# EAGLE design main (EAGLE 9.6.2)
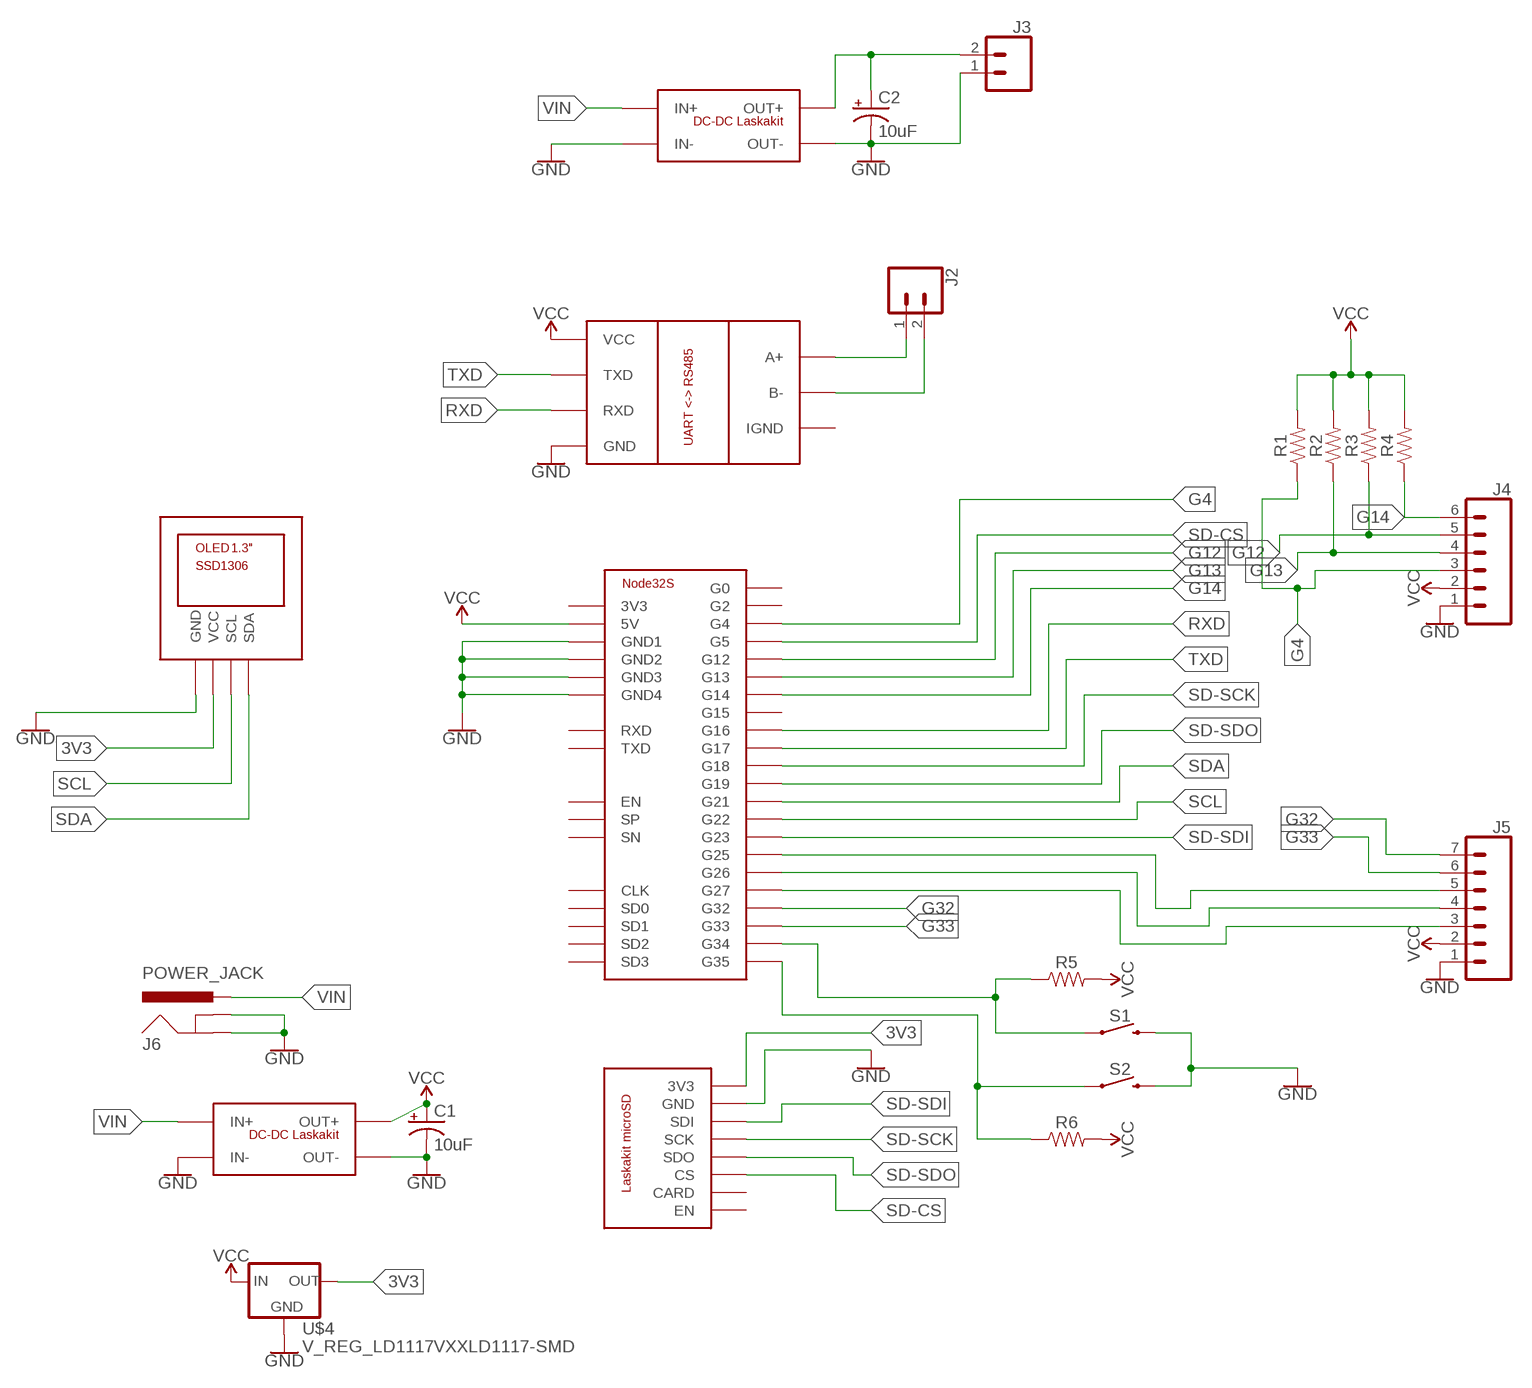
[diagram p0: schematic, sheet 1]

## Parts
C1  10uF  10UF-POLAR-RADIAL-2.5MM-25V-20%  [CPOL-RADIAL-2.5MM-5MM]
C2  10uF  10UF-POLAR-RADIAL-2.5MM-25V-20%  [CPOL-RADIAL-2.5MM-5MM]
J2  CONN_025MM  [SCREWTERMINAL-5MM-2]
J3  CONN_025MM  [SCREWTERMINAL-5MM-2]
J4  CONN_06NO_SILK_FEMALE_PTH  [1X06_NO_SILK]
J5  CONN_07NO_SILK  [1X07_NO_SILK]
J6  POWER_JACK  [POWER_JACK_PTH]
R1  RESISTOR0805  [0805]
R2  RESISTOR0805  [0805]
R3  RESISTOR0805  [0805]
R4  RESISTOR0805  [0805]
R5  RESISTOR0805  [0805]
R6  RESISTOR0805  [0805]
S1  MOMENTARY-SWITCH-SPST-PTH-12MM  [TACTILE_SWITCH_PTH_12MM]
S2  MOMENTARY-SWITCH-SPST-PTH-12MM  [TACTILE_SWITCH_PTH_12MM]
U$1  NODE32S  [NODE32S]
U$2  LASKAKIT_SDCARD  [LASKAKIT_SD_MODULE]
U$3  DC-DC-LASKAKIT  [DC-DC-MODULE-LASKAKIT]
U$4  V_REG_LD1117VXXLD1117-SMD  [SOT223]
U$5  RS485-UART-CONVERTER  [RS485_MODULE]
U$6  OLED_0.96_I2C  [OLED_0.96]
U$7  DC-DC-LASKAKIT  [DC-DC-MODULE-LASKAKIT]

## Nets
3V3: U$2.P$1(3V3) U$4.2(OUT) U$6.P$2(VCC)
G4: J4.3 R1.1 U$1.P$26(G4)
G12: J4.5 R3.1 U$1.P$13(G12)
G13: J4.4 R2.1 U$1.P$15(G13)
G14: J4.6 R4.1 U$1.P$12(G14)
G32: J5.7 U$1.P$7(G32)
G33: J5.6 U$1.P$8(G33)
GND: C1.2(-) C2.2(-) J3.1 J4.1 J5.1 J6.GND J6.GNDBREAK S1.3 S2.3 U$1.P$14(GND1) U$1.P$18(GND2) U$1.P$32(GND3) U$1.P$38(GND4) U$2.P$2(GND) U$3.IN- U$3.OUT- U$4.1(GND) U$5.GND U$6.P$1(GND) U$7.IN- U$7.OUT-
N$1: J2.1 U$5.A+
N$2: J2.2 U$5.B-
N$7: J5.5 U$1.P$9(G25)
N$8: J5.4 U$1.P$10(G26)
N$9: J5.3 U$1.P$11(G27)
N$12: C2.1(+) J3.2 U$7.OUT+
N$13: R6.1 S2.1 U$1.P$6(G35)
N$14: R5.1 S1.1 U$1.P$5(G34)
RXD: U$1.P$27(G16) U$5.RXD
SCL: U$1.P$36(G22) U$6.P$3(SCL)
SD-CS: U$1.P$29(G5) U$2.P$6(CS)
SD-SCK: U$1.P$30(G18) U$2.P$4(SCK)
SD-SDI: U$1.P$37(G23) U$2.P$3(SDI)
SD-SDO: U$1.P$31(G19) U$2.P$5(SDO)
SDA: U$1.P$33(G21) U$6.P$4(SDA)
TXD: U$1.P$28(G17) U$5.TXD
VCC: C1.1(+) J4.2 J5.2 R1.2 R2.2 R3.2 R4.2 R5.2 R6.2 U$1.P$19(5V) U$3.OUT+ U$4.3(IN) U$5.VCC
VIN: J6.PWR U$3.IN+ U$7.IN+
Unconnected: U$1.P$1(3V3) U$1.P$2(EN) U$1.P$3(SP) U$1.P$4(SN) U$1.P$16(SD2) U$1.P$17(SD3) U$1.P$20(CLK) U$1.P$21(SD0) U$1.P$22(SD1) U$1.P$23(G15) U$1.P$24(G2) U$1.P$25(G0) U$1.P$34(RXD) U$1.P$35(TXD) U$2.P$7(CARD) U$2.P$8(EN) U$5.ISOGND(IGND)

## Library data of the parts
C1 C2 = SparkFun-Capacitors:10UF-POLAR: 10.0µF polarized capacitors A capacitor is a passive two-terminal electrical component used to store electrical energy temporarily in an electric field.; PROD_ID: CAP-08440
J2 J3 = SparkFun-Connectors:CONN_02: Multi connection point. Often used as Generic Header-pin footprint for 0.1 inch spaced/style header connections On any of the 0.1 inch spaced packages, you can populate with these: Break Away Headers - Straight <https://www.sparkfun.com/products/116> (PRT-00116) Break Away Male Headers - Right Angle <https://www.sparkfun.com/products/553> (PRT-00553) Female Headers <https://www.sparkfun.com/products/115> (PRT-00115) Break Away Headers - Machine Pin <https://www.sparkfun.com/products/117> (PRT-00117) Break Away Female Headers - Swiss Machine Pin <https://www.sparkfun.com/products/743> (PRT-00743) For SCREWTERMINALS and SPRING TERMINALS visit here: Screw Terimnals on SparkFun.com <https://www.sparkfun.com/search/results?term=Screw+Terminals> (5mm/3.5mm/2.54mm spacing) This device is also useful as a general connection point to wire up your design to another part of your project. Our various solder wires solder well into these plated through hole pads. Hook-Up Wire - Assortment (Stranded, 22 AWG) <https://www.sparkfun.com/products/11375> (PRT-11375) Hook-Up Wire - Assortment (Solid Core, 22 AWG) <https://www.sparkfun.com/products/11367> (PRT-11367) View the entire wire category on our website here <https://www.sparkfun.com/categories/141> Special notes: Molex polarized connector foot print use with: PRT-08233 with associated crimp pins and housings. 2.54_SCREWTERM for use with PRT-10571. 3.5mm Screw Terminal footprints for PRT-08084 5mm Screw Terminal footprints for use with PRT-08432; SF_SKU: PRT-08432
J4 = SparkFun-Connectors:CONN_06: Multi connection point. Often used as Generic Header-pin footprint for 0.1 inch spaced/style header connections On any of the 0.1 inch spaced packages, you can populate with these: Break Away Headers - Straight <https://www.sparkfun.com/products/116> (PRT-00116) Break Away Male Headers - Right Angle <https://www.sparkfun.com/products/553> (PRT-00553) Female Headers <https://www.sparkfun.com/products/115> (PRT-00115) Break Away Headers - Machine Pin <https://www.sparkfun.com/products/117> (PRT-00117) Break Away Female Headers - Swiss Machine Pin <https://www.sparkfun.com/products/743> (PRT-00743) Arduino Stackable Header - 6 Pin <https://www.sparkfun.com/products/9280> (PRT-09280) Screw Terminals 2.54mm Pitch (6-Pin) <https://www.sparkfun.com/products/16499> (PRT-16499) For SCREWTERMINALS and SPRING TERMINALS visit here: Screw Terimnals on SparkFun.com <https://www.sparkfun.com/search/results?term=Screw+Terminals> (5mm/3.5mm/2.54mm spacing) This device is also useful as a general connection point to wire up your design to another part of your project. Our various solder wires solder well into these plated through hole pads. Hook-Up Wire - Assortment (Stranded, 22 AWG) <https://www.sparkfun.com/products/11375> (PRT-11375) Hook-Up Wire - Assortment (Solid Core, 22 AWG) <https://www.sparkfun.com/products/11367> (PRT-11367) View the entire wire category on our website here <https://www.sparkfun.com/categories/141>; PROD_ID: CONN-08437
J5 = SparkFun-Connectors:CONN_07: Multi connection point. Often used as Generic Header-pin footprint for 0.1 inch spaced/style header connections On any of the 0.1 inch spaced packages, you can populate with these: Break Away Headers - Straight <https://www.sparkfun.com/products/116> (PRT-00116) Break Away Male Headers - Right Angle <https://www.sparkfun.com/products/553> (PRT-00553) Female Headers <https://www.sparkfun.com/products/115> (PRT-00115) Break Away Headers - Machine Pin <https://www.sparkfun.com/products/117> (PRT-00117) Break Away Female Headers - Swiss Machine Pin <https://www.sparkfun.com/products/743> (PRT-00743) For SCREWTERMINALS and SPRING TERMINALS visit here: Screw Terimnals on SparkFun.com <https://www.sparkfun.com/search/results?term=Screw+Terminals> (5mm/3.5mm/2.54mm spacing) This device is also useful as a general connection point to wire up your design to another part of your project. Our various solder wires solder well into these plated through hole pads. Hook-Up Wire - Assortment (Stranded, 22 AWG) <https://www.sparkfun.com/products/11375> (PRT-11375) Hook-Up Wire - Assortment (Solid Core, 22 AWG) <https://www.sparkfun.com/products/11367> (PRT-11367) View the entire wire category on our website here <https://www.sparkfun.com/categories/141> Special notes: Molex polarized connector foot print use with SKU : PRT-08231 with associated crimp pins and housings. 1MM SMD Version SKU: PRT-10208 NOTES ON THE VARIANTS LOCK and LOCK_LONGPADS... This footprint was designed to help hold the alignment of a through-hole component (i.e. 6-pin header) while soldering it into place. You may notice that each hole has been shifted either up or down by 0.005 of an inch from it's more standard position (which is a perfectly straight line). This slight alteration caused the pins (the squares in the middle) to touch the edges of the holes. Because they are alternating, it causes a "brace" to hold the component in place. 0.005 has proven to be the perfect amount of "off-center" position when using our standard breakaway headers. Although looks a little odd when you look at the bare footprint, once you have a header in there, the alteration is very hard to notice. Also,if you push a header all the way into place, it is covered up entirely on the bottom side.
J6 = SparkFun-Connectors:POWER_JACK: Power Jack Connector This is the standard 5.5mm barrel jack for power. The PTH is the most common, proven, reliable, footprint. The Slot footprint only works if the mill layer is transmitted to the PCB fab house so be warned. Here are the connectors we sell at SparkFun: DC Barrel Power Jack/Connector <https://www.sparkfun.com/products/119> (PRT-00119) DC Barrel Power Jack/Connector (SMD) <https://www.sparkfun.com/products/12748> (PRT-12748) DC Barrel Jack Adapter - Breadboard Compatible <https://www.sparkfun.com/products/10811> (PRT-10811) It is used on this SparkFun product (and many, many others): SparkFun RedBoard - Programmed with Arduino <https://www.sparkfun.com/products/12757> (DEV-12757) Also, if you need a mating power supply or connector, please check these out: Wall Adapter Power Supply - 9VDC 650mA <https://www.sparkfun.com/products/298> (TOL-00298) DC Barrel Jack Adapter - Male <https://www.sparkfun.com/products/10287> (PRT-10287); PROD_ID: CONN-08197
R1-R6 = SparkFun-Resistors:RESISTOR: Generic Resistor Package
S1 S2 = SparkFun-Switches:MOMENTARY-SWITCH-SPST: Momentary Switch (Pushbutton) - SPST Normally-open (NO) SPST momentary switches (buttons, pushbuttons). Variants PTH-12MM - 12mm square, through-hole Momentary Pushbutton Switch - 12mm Square <https://www.sparkfun.com/products/9190> (COM-09190) PTH-6.0MM, PTH-6.0MM-KIT - 6.0mm square, through-hole Mini Pushbutton Switch <https://www.sparkfun.com/products/97> (COM-00097) KIT package intended for soldering kit's - only one side of pads' copper is exposed. PTH-RIGHT-ANGLE-KIT - Right-angle, through-hole Right Angle Tactile Button <https://www.sparkfun.com/products/10791> - Used on SparkFun BigTime Watch Kit <https://www.sparkfun.com/products/11734> SMD-12MM - 12mm square, surface-mount Tactile Button - SMD (12mm) <https://www.sparkfun.com/products/12993> (COM-12993) Used on SparkFun PicoBoard <https://www.sparkfun.com/products/11888> SMD-4.5MM - 4.5mm Square Trackball Switch Used on SparkFun Blackberry Trackballer Breakout <https://www.sparkfun.com/products/13169> SMD-4.6MMX2.8MM - 4.60mm x 2.80mm, surface mount Used on SparkFun Pro Micro - RP2040 <https://www.sparkfun.com/products/17717> SMD-5.2MM, SMD-5.2-REDUNDANT - 5.2mm square, surface-mount Mini Pushbutton Switch - SMD <https://www.sparkfun.com/products/8720> (COM-08720) Used on Arduino Pro Mini <https://www.sparkfun.com/products/11114> REDUNDANT package connects both switch circuits together SMD-6.0X3.5MM - 6.0 x 3.5mm, surface mount Momentary Reset Switch SMD <https://www.sparkfun.com/products/8229> (COM-08229) SMD-6.2MM-TALL - 6.2mm square, surface mount Tactile Button - SMD (6mm) <https://www.sparkfun.com/products/12992> Used on SparkFun Digital Sandbox <https://www.sparkfun.com/products/12651> SMD-RIGHT-ANGLE - Right-angle, surface mount Used on SparkFun Block for Intel® Edison - Arduino <https://www.sparkfun.com/products/13036>; PROD_ID: SWCH-09185; SF_SKU: COM-09190
U$1 = Hatch Prototype:NODE32S
U$2 = Hatch Prototype:LASKAKIT_SDCARD
U$3 U$7 = Hatch Prototype:DC-DC-LASKAKIT
U$4 = SparkFun-IC-Power:V_REG_LD1117VXX: LD1117VXX voltage regulator. We carry the 3.3V version (COM-00526) in TO-220 package.; PROD_ID: VREG-13917
U$5 = Hatch Prototype:RS485-UART-CONVERTER
U$6 = Hatch Prototype:OLED_0.96_I2C

## Board
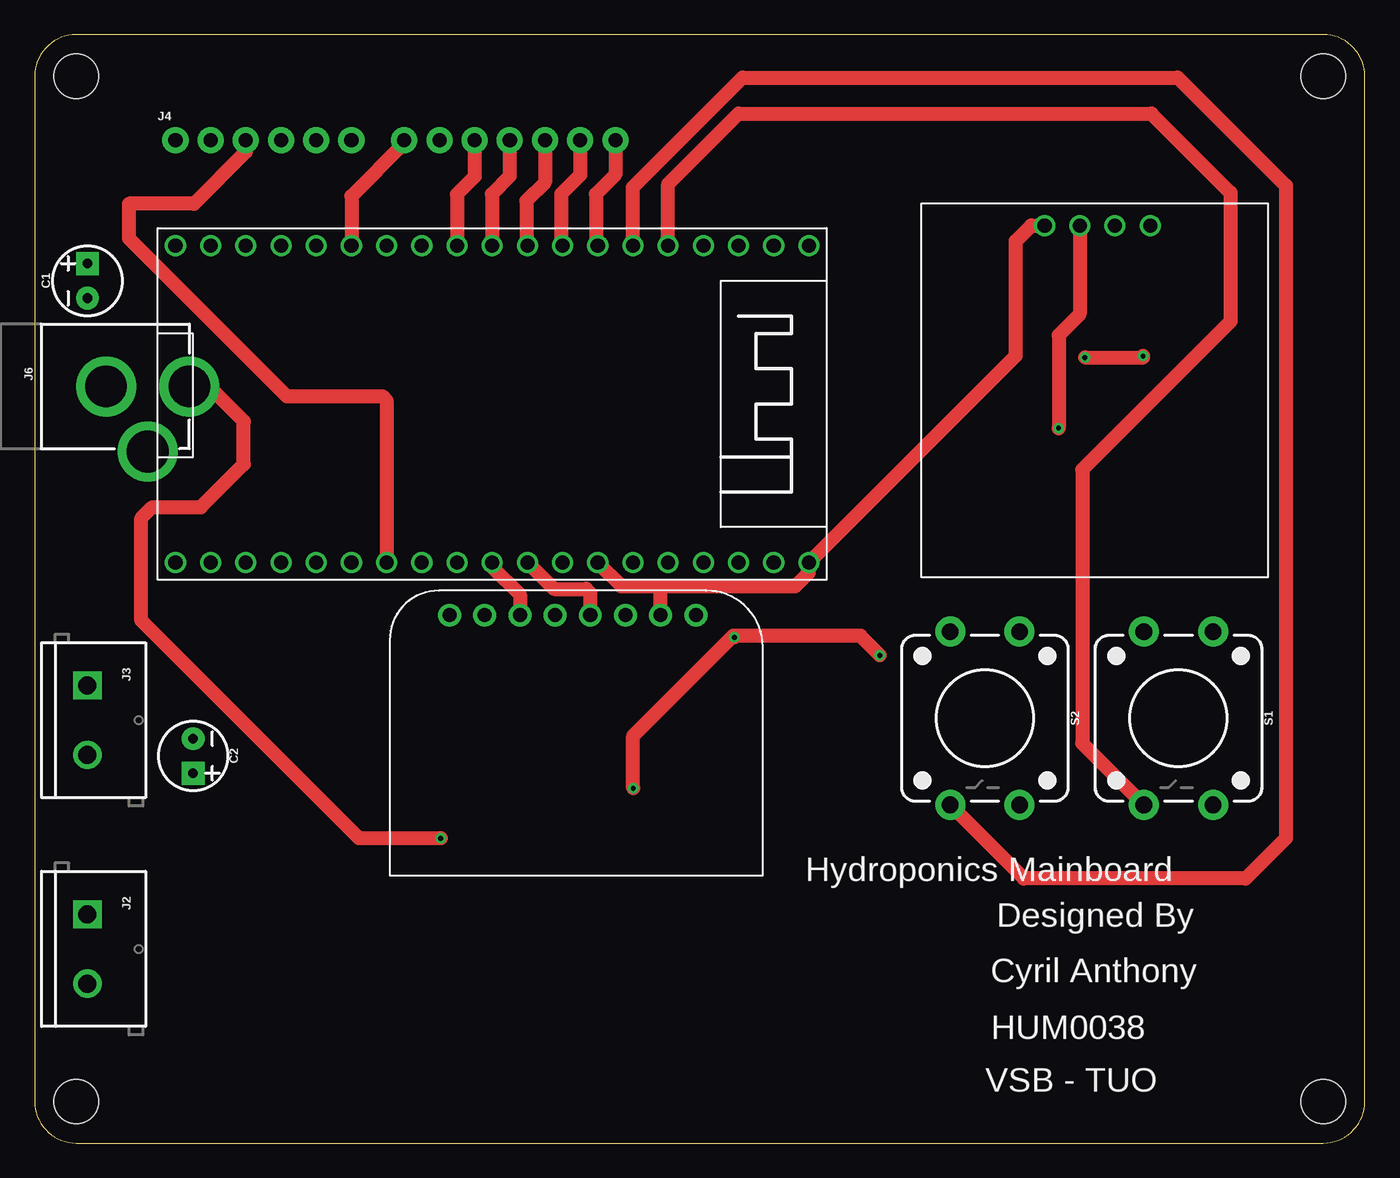
[diagram p1: board, top side]
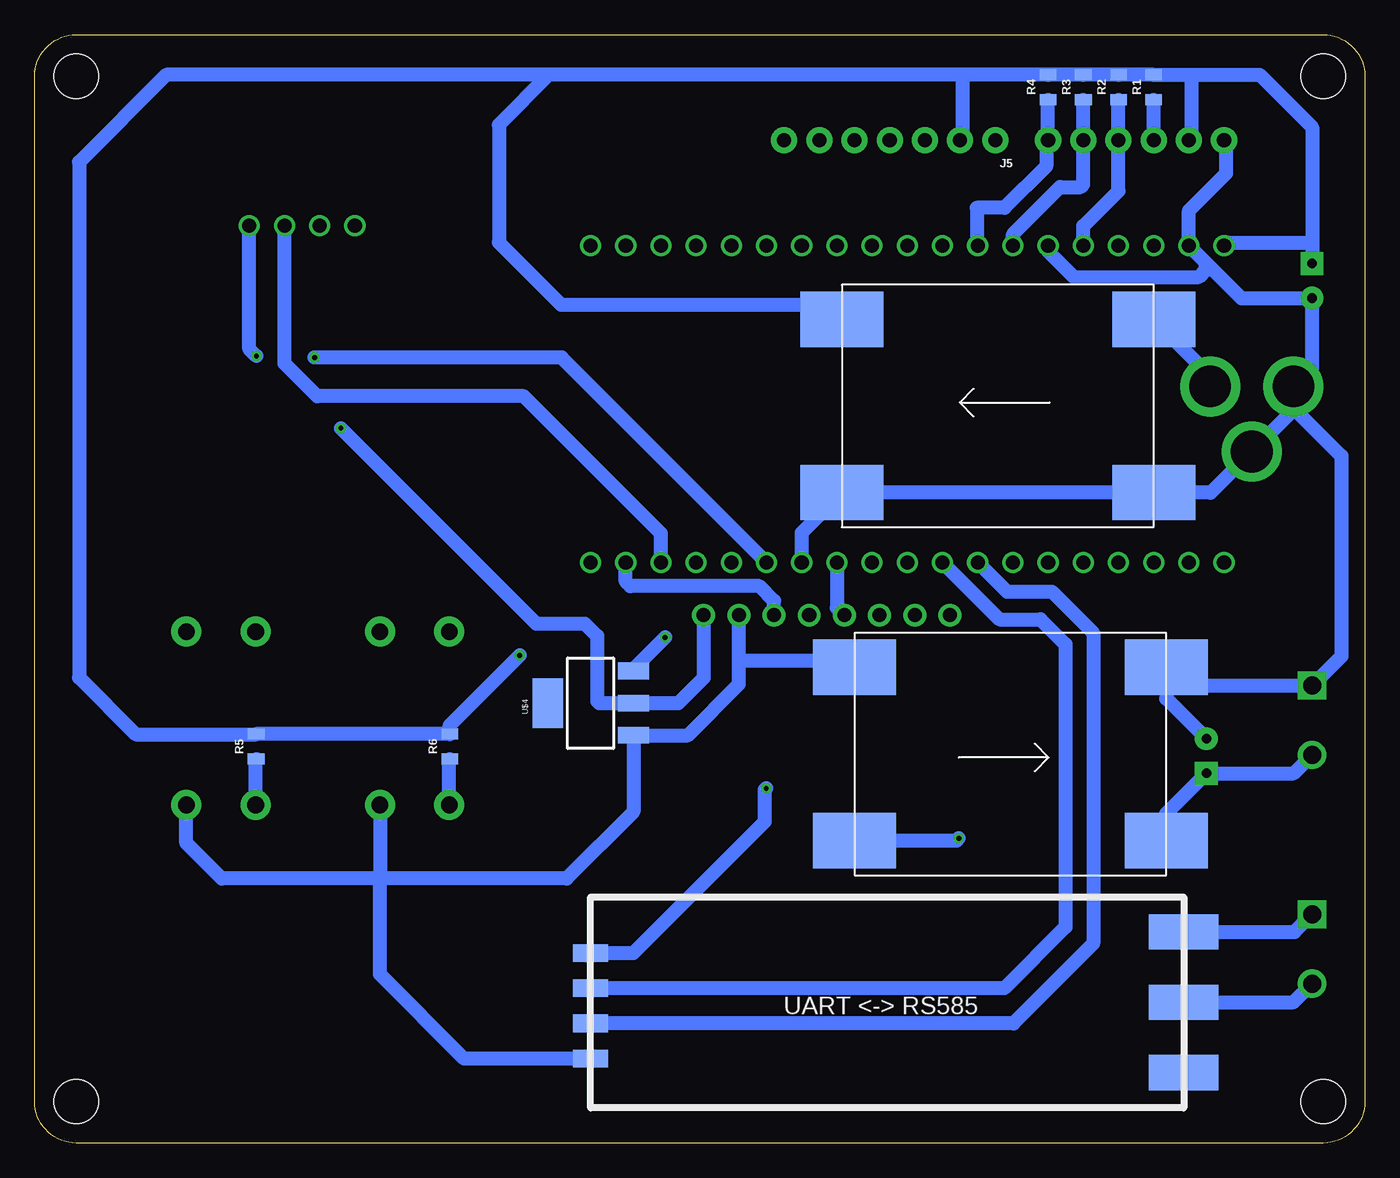
[diagram p2: board, bottom side, seen from below]

Size 96 x 80 mm. Coordinates in mm from the lower left corner, seen from the top.
Outline: 96,3 96,77 arc90 93,80 3,80 arc90 0,77 0,3 arc90 3,0 93,0 arc90 96,3
Copper layers (1*16): Top 0.035mm / dielectric 1.5mm / Bottom 0.035mm
Design rules "default *": minimum track width 6mil, minimum drill 0.35mm, track to track 6mil, track to pad 6mil, pad to pad 6mil, via to via 6mil, smd to smd 6mil, copper to edge 40mil, drill to drill 6mil, minimum pad ring 10mil, minimum via ring 8mil, stop-mask expansion 4mil, vias tented up to drill 24mil, thermal gap 10mil
Holes 3.2 mm at 3,77 93,77 93,3 3,3

### Footprints (pad centres in the part's own frame; a part is rotated, then mirrored left to right if it is on the bottom)
CPOL-RADIAL-2.5MM-5MM = drill 0.7 pad 1.651 square: 1 1.25,0 | drill 0.7 pad 1.651: 2 -1.25,0
SCREWTERMINAL-5MM-2 = drill 1.3 pad 2.032 square: 1 0,0 | drill 1.3 pad 2.032: 2 5,0
1X06_NO_SILK = drill 1.016 pad 1.88: 1 0,0; 2 2.54,0; 3 5.08,0; 4 7.62,0; 5 10.16,0; 6 12.7,0
1X07_NO_SILK = drill 1.016 pad 1.88: 1 0,0; 2 2.54,0; 3 5.08,0; 4 7.62,0; 5 10.16,0; 6 12.7,0; 7 15.24,0
POWER_JACK_PTH = drill 2.997 pad 4.318: GND 0,7.7; GNDBREAK 4.7,10.7; PWR 0,13.7
0805 = smd 0.8 x 1.2: 1 -0.9,0; 2 0.9,0
TACTILE_SWITCH_PTH_12MM = drill 1.2 pad 2.159: 1 6.25,-2.5; 2 -6.25,-2.5; 3 6.25,2.5; 4 -6.25,2.5
NODE32S = drill 1.016: P$1 0,0; P$2 2.54,0; P$3 5.08,0; P$4 7.62,0; P$5 10.16,0; P$6 12.7,0; P$7 15.24,0; P$8 17.78,0; P$9 20.32,0; P$10 22.86,0; P$11 25.4,0; P$12 27.94,0; P$13 30.48,0; P$14 33.02,0; P$15 35.56,0; P$16 38.1,0; P$17 40.64,0; P$18 43.18,0; P$19 45.72,0; P$20 45.72,22.86; P$21 43.18,22.86; P$22 40.64,22.86; P$23 38.1,22.86; P$24 35.56,22.86; P$25 33.02,22.86; P$26 30.48,22.86; P$27 27.94,22.86; P$28 25.4,22.86; P$29 22.86,22.86; P$30 20.32,22.86; P$31 17.78,22.86; P$32 15.24,22.86; P$33 12.7,22.86; P$34 10.16,22.86; P$35 7.62,22.86; P$36 5.08,22.86; P$37 2.54,22.86; P$38 0,22.86
LASKAKIT_SD_MODULE = drill 1.016 pad 1.651: P$1 0,0; P$2 2.54,0; P$3 5.08,0; P$4 7.62,0; P$5 10.16,0; P$6 12.7,0; P$7 15.24,0; P$8 17.78,0
DC-DC-MODULE-LASKAKIT = smd 4 x 6: IN+ 15,0; IN- 2.5,0; OUT+ 15,22.5; OUT- 2.5,22.5
SOT223 = smd 1.219 x 2.235: 1 -2.311,-3.099; 2 0,-3.099; 3 2.311,-3.099 | smd 3.6 x 2.2: 4 0,3.099
RS485_MODULE = smd 5 x 2.55: A+ 42.8,12.7; B- 42.8,7.62; ISOGND 42.8,2.54 | smd 2.5 x 1.27: GND 0,3.56; RXD 0,6.1; TXD 0,8.64; VCC 0,11.18
OLED_0.96 = drill 1.016: P$1 8.89,25.4; P$2 11.43,25.4; P$3 13.97,25.4; P$4 16.51,25.4

### Placement (x,y rotation side)
C1  3.81,62.23 90 top
C2  11.43,27.94 270 top
J2  3.81,16.51 270 top
J3  3.81,33.02 270 top
J4  10.16,72.39 0 top
J5  26.67,72.39 180 bottom
J6  -2.54,54.61 270 top
R1  15.24,76.2 90 bottom
R2  17.78,76.2 90 bottom
R3  20.32,76.2 90 bottom
R4  22.86,76.2 90 bottom
R5  80.01,28.62 90 bottom
R6  66.04,28.62 90 bottom
S1  82.55,30.66 270 top
S2  68.58,30.66 270 top
U$1  55.88,64.77 180 top
U$2  47.72,38.1 180 top
U$3  15.24,44.45 90 bottom
U$4  55.88,31.75 90 bottom
U$5  55.88,2.54 0 bottom
U$6  64,40.82 0 top
U$7  36.83,36.83 270 bottom

### Tracks (layer width: path | path; a pad name or v marks a point on that pad's centre or on a via)
3V3  (via drill 0.35)
  Top 1: U$6.P$2 75.43,59.83 73.9,58.3 v73.9,51.6
  Bottom 1: U$2.P$1 47.7,38.08 47.7,33.6 49.55,31.75 U$4.2 55.25,31.75 55.4,31.9 55.4,36.6 56.3,37.5 59.8,37.5 v73.9,51.6
G4
  Top 1: J4.3 15.24,71.54 11.5,67.8 6.8,67.8 6.8,65.3 18.2,53.9 25.1,53.9 25.4,53.6 U$1.P$26
  Bottom 1: J4.3 R1.1
G12
  Bottom 1: R3.1 J4.5 20.32,69.18 20.5,69 22,69 25.4,65.6 U$1.P$13
G13
  Bottom 1: R2.1 J4.4 17.78,68.72 20.32,66.18 U$1.P$15
G14
  Bottom 1: R4.1 J4.6 23,72.25 23,70.5 26,67.5 28,67.5 28,64.83 U$1.P$12
G32
  Top 1: J5.7 41.91,69.91 40.5,68.5 40.5,64.91 U$1.P$7
G33
  Top 1: J5.6 39.37,69.87 38,68.5 38,64.87 U$1.P$8
GND
  Top 1: J5.1 26.67,72.17 22.86,68.36 U$1.P$14 | U$1.P$32 42.35,40.2 45.3,40.2 | 45.3,40.2 54.9,40.2 55.88,41.18 U$1.P$38 70.8,56.83 70.8,65.1 71.92,66.22 U$6.P$1 | U$2.P$2 45.18,40.08 45.3,40.2
  Bottom 1: J4.1 10,72.23 10,70 12.7,67.3 U$1.P$18 11.46,63.53 | 11.46,63.53 8.91,60.98 C1.2 3.81,55.96 J6.GND | U$1.P$14 22.86,64.36 21,62.5 12,62.5 11.46,63.03 11.46,63.53 | U$1.P$32 40.64,44.05 U$3.OUT- U$3.IN- | 45.18,34.8 45.18,33.12 48.86,29.44 U$4.1 52.78,23.92 57.6,19.1 71.1,19.1 | 45.18,34.8 U$2.P$2 | U$7.IN- 37.3,34.8 45.18,34.8 | U$3.IN- 11.12,46.95 J6.GNDBREAK 5.16,52.91 J6.GND | C2.2 14.33,32.09 U$7.OUT- 13.02,33.02 J3.1 1.7,35.13 1.7,49.6 5.16,53.06 J6.GND | U$3.IN- 36.65,46.95 36.7,46.9 | 71.1,19.1 82.5,19.1 85.05,21.65 S1.3 | S2.3 71.08,19.12 | 71.08,19.12 71.1,19.1 | U$5.GND 65,6.1 71.08,12.18 71.08,19.12
N$1
  Bottom 1: U$5.A+ 5.08,15.24 J2.1
N$2
  Bottom 1: U$5.B- 5.16,10.16 J2.2
N$7
  Top 1: J5.5 36.83,69.33 35.5,68 35.5,64.83 U$1.P$9
N$8
  Top 1: J5.4 34.29,69.79 33,68.5 33,64.79 U$1.P$10
N$9
  Top 1: J5.3 31.75,69.75 30.48,68.48 U$1.P$11
N$12
  Bottom 1: U$7.OUT+ 14.33,23.79 C2.1 5.14,26.69 J3.2
N$13
  Top 1: U$1.P$6 43.18,68.98 51.1,76.9 82.5,76.9 90.3,69.1 90.3,22 87.4,19.1 71.39,19.1 S2.1
  Bottom 1: S2.1 66.08,27.68 R6.1
N$14
  Top 1: U$1.P$5 45.72,69.22 50.8,74.3 80.6,74.3 86.3,68.6 86.3,59.3 75.6,48.6 75.6,28.86 S1.1
  Bottom 1: S1.1 80.05,27.68 R5.1
RXD
  Bottom 1: U$1.P$27 25.83,39.8 22.6,39.8 19.6,36.8 19.6,14.4 25.36,8.64 U$5.RXD
SCL
  Bottom 1: U$1.P$36 50.8,44 60.7,53.9 75.6,53.9 77.97,56.27 U$6.P$3
SD-CS
  Top 1: U$1.P$29 33.02,41.58 35.02,39.58 U$2.P$6
SD-SCK
  Top 1: U$1.P$30 37.47,40 39.8,40 40.1,39.7 U$2.P$4
SD-SDI
  Bottom 1: U$2.P$3 42.64,39.14 43.7,40.2 53,40.2 53.34,40.54 U$1.P$37
SD-SDO
  Bottom 1: U$1.P$31 38.1,38.64 U$2.P$5
SDA  (via drill 0.35)
  Top 1: v75.8,56.7 80,56.7 v80,56.8
  Bottom 1: U$1.P$33 57.97,56.7 v75.8,56.7 | v80,56.8 80.51,57.31 U$6.P$4
TXD
  Bottom 1: U$1.P$28 26.37,37.8 23.4,37.8 21.6,36 21.6,15.6 26.02,11.18 U$5.TXD
VCC  (via drill 0.35)
  Top 1: v43.2,25.6 43.2,29.4 50.4,36.6 | 50.4,36.6 v50.5,36.5 | v61,35.2 59.6,36.6 50.4,36.6
  Bottom 1: 29,77.1 R4.2 R3.2 R2.2 R1.2 12.5,77.1 | 29,77.1 58.9,77.1 | 58.9,77.1 62.5,73.5 62.5,65 58,60.5 38.79,60.5 U$3.OUT+ | 12.5,77.1 7.6,77.1 3.81,73.31 3.81,65 | 3.81,65 C1.1 | J4.2 12.5,72.59 12.5,77.1 | U$1.P$19 9.93,65 3.81,65 | J5.2 29,72.6 29,77.1 | U$5.VCC 52.78,13.72 43.3,23.2 43.3,25.5 v43.2,25.6 | v50.5,36.5 52.78,34.22 U$4.3 | v61,35.2 66.04,30.16 R6.2 R5.2 80.03,29.5 88.7,29.5 92.8,33.6 92.8,70.8 86.5,77.1 58.9,77.1
VIN  (via drill 0.35)
  Top 1: v29.3,22 23.4,22 7.7,37.7 7.7,45.1 8.5,45.9 12,45.9 15.1,49 15.1,52.1 12.59,54.61 J6.PWR
  Bottom 1: U$3.IN+ 11.16,55.37 J6.PWR | U$7.IN+ 29.47,21.83 v29.3,22

### Text on the board
tPlace: Hydroponics Mainboard | Designed By | Cyril Anthony | HUM0038 | VSB - TUO